# Altium project PFC-01v4.03.PrjPCB
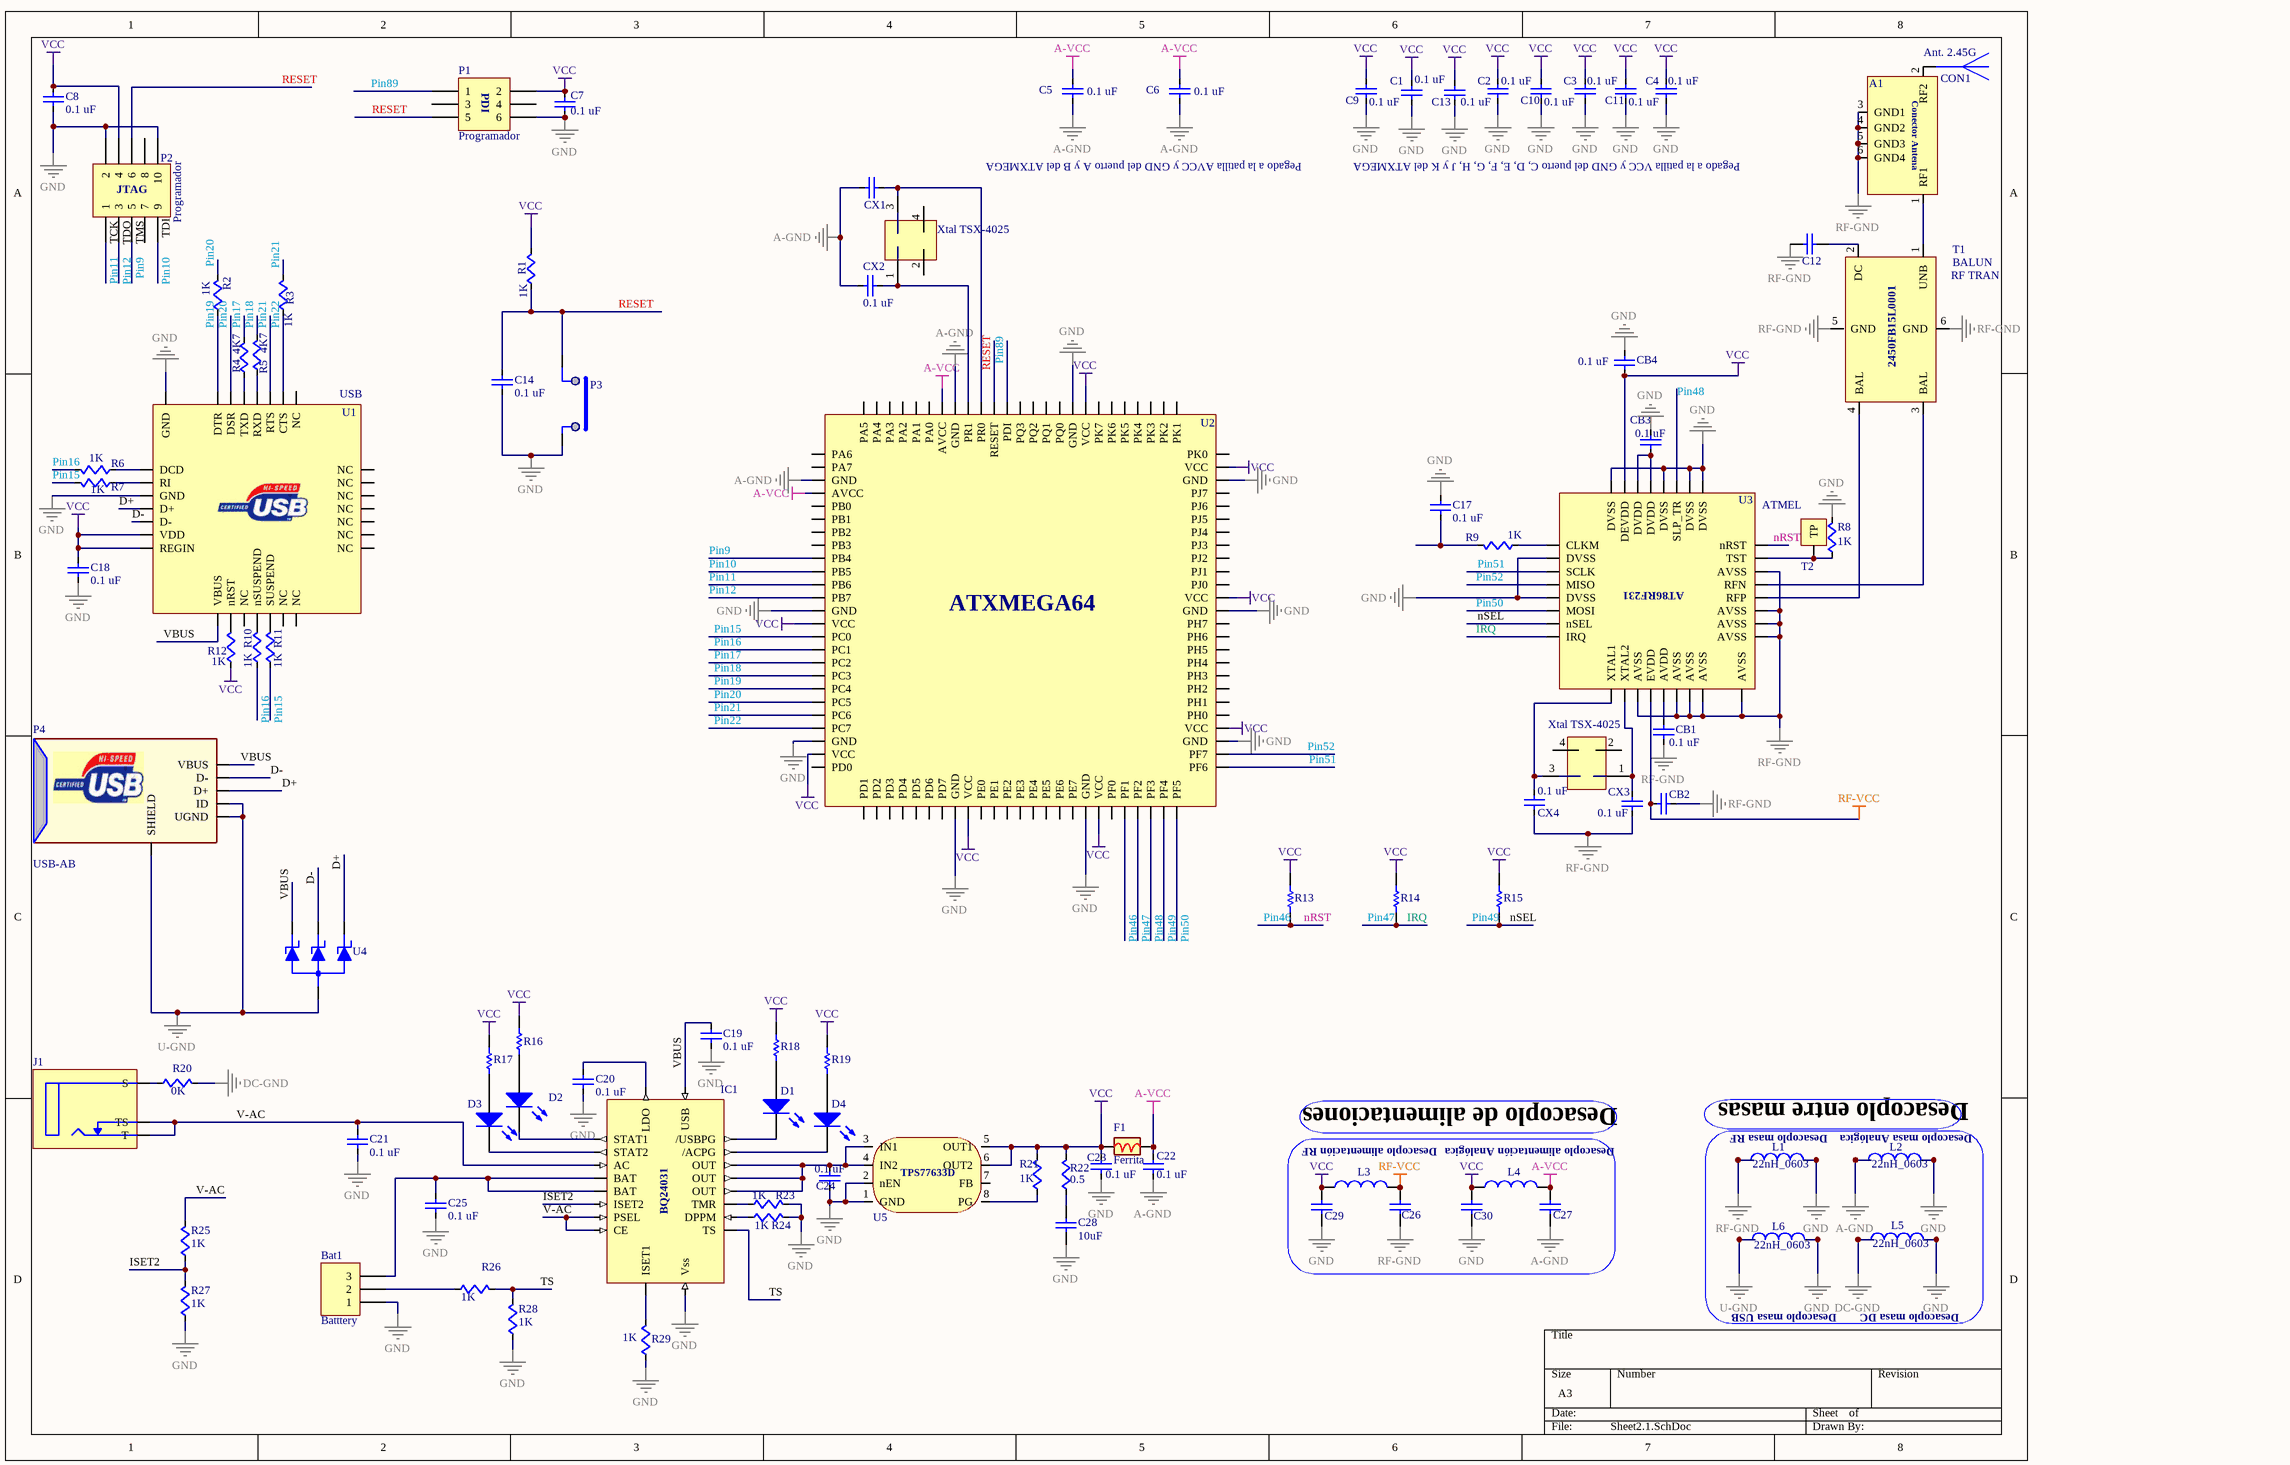
[diagram p0: Sheet2.1.SchDoc]
1 sheet, 94 parts. Net scope: global (net labels, ports and power ports of the same name join across sheets).
Board file: PFCv04.03.PcbDoc

## Sheet Sheet2.1.SchDoc
size A3; PageSetup: Record=PageOptions|CenterHorizontal=True|CenterVertical=True|PrintScale=0.73|XCorrection=1.00|YCorrection=1.00|PrintKind=1|BorderSize=5000000|LeftOffset=0|BottomOffset=0|Orientation=2|PaperLength=1000|PaperWidth=1000|Scale=100|PaperSource=15|PrintQuality=600|MediaType=1|DitherType=10|PaperKind=A4|PrintScaleMode=1

### Parts
A1  Ant. 2.45G  [ANTENNA CHIP]
Bat1  Batttery  [HDR1X3]
C1  Valor: 0.1 uF  [0402]  (hidden comment: C)
C2  Valor: 0.1 uF  [0402]  (hidden comment: C)
C3  Valor: 0.1 uF  [0402]  (hidden comment: C)
C4  Valor: 0.1 uF  [0402]  (hidden comment: C)
C5  Valor: 0.1 uF  [0402]  (hidden comment: C)
C6  Valor: 0.1 uF  [0402]  (hidden comment: C)
C7  Valor: 0.1 uF  [0402]  (hidden comment: C)
C8  Valor: 0.1 uF  [0402]  (hidden comment: C)
C9  Valor: 0.1 uF  [0402]  (hidden comment: C)
C10  Valor: 0.1 uF  [0402]  (hidden comment: C)
C11  Valor: 0.1 uF  [0402]  (hidden comment: C)
C12  22pF_0402  [0402]  (value not drawn)
C13  Valor: 0.1 uF  [0402]  (hidden comment: C)
C14  Valor: 0.1 uF  [0402]  (hidden comment: C)
C17  Valor: 0.1 uF  [0402]  (hidden comment: C)
C18  Valor: 0.1 uF  [0402]  (hidden comment: C)
C19  Valor: 0.1 uF  [0402]  (hidden comment: C)
C20  Valor: 0.1 uF  [0402]  (hidden comment: C)
C21  Valor: 0.1 uF  [0402]  (hidden comment: C)
C22  Valor: 0.1 uF  [0402]  (hidden comment: C)
C23  Valor: 0.1 uF  [0402]  (hidden comment: C)
C24  Valor: 0.1 uF  [0402]  (hidden comment: C)
C25  Valor: 0.1 uF  [0402]  (hidden comment: C)
C26  100nF_0805  [0805]  (value not drawn)
C27  100nF_0805  [0805]  (value not drawn)
C28  10uF  [0805]
C29  100nF_0805  [0805]  (value not drawn)
C30  100nF_0805  [0805]  (value not drawn)
CB1  Valor: 0.1 uF  [0402]  (hidden comment: C)
CB2  Valor: 0.1 uF  [0402]  (hidden comment: C)
CB3  Valor: 0.1 uF  [0402]  (hidden comment: C)
CB4  Valor: 0.1 uF  [0402]  (hidden comment: C)
CON1  Conector Antena  [MM8430-2600_Coaxial Connectors]  (value not drawn)
CX1  C  [0402]  (value not drawn)
CX2  Valor: 0.1 uF  [0402]  (hidden comment: C)
CX3  Valor: 0.1 uF  [0402]  (hidden comment: C)
CX4  C  [0402]  (value not drawn)
D1  Diodo Led  [Diode Led]  (value not drawn)
D2  Diodo Led  [Diode Led]  (value not drawn)
D3  Diodo Led  [Diode Led]  (value not drawn)
D4  Diodo Led  [Diode Led]  (value not drawn)
F1  Ferrita  [0603]
IC1  BQ24031  [BQ24031]  (value not drawn)
J1  CAMSHOT  [MJ-2509N]  (value not drawn)
L1  22nH_0603  [0603]
L2  22nH_0603  [0603]
L3  22nH_0603  [0603]  (value not drawn)
L4  22nH_0603  [0603]  (value not drawn)
L5  22nH_0603  [0603]
L6  22nH_0603  [0603]
P1  Programador  [HDR2X3]
P2  Programador  [HDR2X5]
P3  Pulsador  [PUSH-BUTTON-W]  (value not drawn)
P4  USB-AB  [USB-MINI-AB-SMT]
R1  value 1K  [0603]  (hidden comment: R 0402)
R2  value 1K  [0603]  (hidden comment: R 0402)
R3  value 1K  [0603]  (hidden comment: R 0402)
R4  value 4K7  [0603]  (hidden comment: R 0402)
R5  value 4K7  [0603]  (hidden comment: R 0402)
R6  value 1K  [0603]  (hidden comment: R 0402)
R7  value 1K  [0603]  (hidden comment: R 0402)
R8  value 1K  [0603]  (hidden comment: R 0402)
R9  value 1K  [0603]  (hidden comment: R 0402)
R10  value 1K  [0603]  (hidden comment: R 0402)
R11  value 1K  [0603]  (hidden comment: R 0402)
R12  value 1K  [0603]  (hidden comment: R 0402)
R13  16.9kohm-0805  [0805]  (value not drawn)
R14  16.9kohm-0805  [0805]  (value not drawn)
R15  16.9kohm-0805  [0805]  (value not drawn)
R16  16.9kohm-0805  [0805]  (value not drawn)
R17  16.9kohm-0805  [0805]  (value not drawn)
R18  16.9kohm-0805  [0805]  (value not drawn)
R19  16.9kohm-0805  [0805]  (value not drawn)
R20  value 0K  [0603]  (hidden comment: R 0402)
R21  value 1K  [0603]  (hidden comment: R 0402)
R22  value 0.5  [0603]  (hidden comment: R 0402)
R23  value 1K  [0603]  (hidden comment: R 0402)
R24  value 1K  [0603]  (hidden comment: R 0402)
R25  value 1K  [0603]  (hidden comment: R 0402)
R26  value 1K  [0603]  (hidden comment: R 0402)
R27  value 1K  [0603]  (hidden comment: R 0402)
R28  value 1K  [0603]  (hidden comment: R 0402)
R29  value 1K  [0603]  (hidden comment: R 0402)
T1  BALUN  [BALUN]
T2  TESTPOINT  [TESTPOINT]  (value not drawn)
U1  USB  [QFN28_5X5]
U2  XMEGA  [Quad100]  (value not drawn)
U3  RF TRAN  Fabricante: ATMEL  [QFN32_50]
U4  TVS  [SOT-143]  (value not drawn)
U5  TPS77633D  [TPS77633D]  (value not drawn)
Xtal1  Xtal TSX-4025  [TSX-4025]
Xtal2  Xtal TSX-4025  [TSX-4025]

### Blocks framed on the sheet
Desacoplo alimentación RF: C26 C27 C29 C30 L3 L4

### Nets
A-GND: C5.2 C6.2 C22.2 C27.1 CX1.1 CX2.1 L2.1 U2.3(GND) U2.93(GND)
A-VCC: C5.1 C6.1 C22.1 C27.2 F1.2(Y) L4.2 U2.4(AVCC) U2.94(AVCC)
DC-GND: L5.1 R20.2
GND: Bat1.1 C1.2 C2.2 C3.2 C4.2 C7.2 C8.2 C9.2 C10.2 C11.2 C13.2 C14.2 C17.1 C18.2 C19.2 C20.2 C21.2 C23.2 C24.2 C25.2 C28.1 C29.1 C30.1 CB3.1 CB4.2 IC1.11(Vss) L1.2 L2.2 L5.2 L6.2 P1.6 P2.2 P2.10 P3.2 R8.2 R23.2 R24.2 R27.1 R28.1 R29.1 U1.0(GND) U1.3(GND) U2.13(GND) U2.23(GND) U2.33(GND) U2.43(GND) U2.53(GND) U2.63(GND) U2.73(GND) U2.84(GND) U3.9(DVSS) U3.10(DVSS) U3.12(DVSS) U3.16(DVSS) U3.18(DVSS) U3.21(DVSS) U5.1(GND) U5.2(nEN)
RF-GND: C12.1 C26.1 CB1.1 CB2.1 CON1.3(GND1) CON1.4(GND2) CON1.5(GND3) CON1.6(GND4) CX3.1 CX4.1 L1.1 T1.5(GND) T1.6(GND) U3.1(AVSS) U3.2(AVSS) U3.3(AVSS) U3.6(AVSS) U3.27(AVSS) U3.30(AVSS) U3.31(AVSS) U3.32(AVSS) U3.33(AVSS)
RF-VCC: C26.2 CB2.2 L3.2 U3.28(EVDD)
U-GND: L6.1 P4.ID P4.SHIELD P4.UGND U4.1(GND)
VCC: C1.1 C2.1 C3.1 C4.1 C7.1 C8.1 C9.1 C10.1 C11.1 C13.1 C18.1 C23.1 C29.2 C30.2 CB4.1 F1.1(X) L3.1 L4.1 P1.2 P2.4 R1.2 R12.1 R13.2 R14.2 R15.2 R16.2 R17.2 R18.2 R19.2 R21.2 R22.2 U1.6(VDD) U1.7(REGIN) U2.14(VCC) U2.24(VCC) U2.34(VCC) U2.44(VCC) U2.54(VCC) U2.64(VCC) U2.74(VCC) U2.83(VCC) U3.15(DEVDD) U5.5(OUT1) U5.6(OUT2)
D+: P4.D+ U1.4(D+) U4.2(C)
D-: P4.D- U1.5(D-) U4.3(C)
IRQ: R14.1 U2.47(PF2) U3.24(IRQ)  [also labelled Pin47]
ISET2: IC1.7(ISET2) R25.1 R27.2
nRST: R13.1 U2.46(PF1) U3.8(nRST)  [also labelled Pin46]
nSEL: R15.1 U2.49(PF4) U3.23(nSEL)  [also labelled Pin49]
Pin9: P2.5 U2.9(PB4)
Pin10: P2.9 U2.10(PB5)
Pin11: P2.1 U2.11(PB6)
Pin12: P2.3 U2.12(PB7)
Pin15: R7.2 R11.1 U2.15(PC0)
Pin16: R6.2 R10.1 U2.16(PC1)
Pin17: R4.2 U2.17(PC2)
Pin18: R5.2 U2.18(PC3)
Pin19: R2.1 U1.28(DTR) U2.19(PC4)
Pin20: R2.2 U1.27(DSR) U2.20(PC5)
Pin21: R3.2 U1.24(RTS) U2.21(PC6)
Pin22: R3.1 U1.23(CTS) U2.22(PC7)
Pin48: U2.48(PF3) U3.11(SLP_TR)
Pin50: U2.50(PF5) U3.22(MOSI)
Pin51: U2.51(PF6) U3.19(SCLK)
Pin52: U2.52(PF7) U3.20(MISO)
Pin89: P1.1 U2.89(PDI)
RESET: C14.1 P1.5 P2.6 P3.1 R1.1 U2.90(RESET)
TS: IC1.12(TS) R26.2 R28.2
V-AC: C21.1 IC1.4(AC) IC1.8(PSEL) IC1.9(CE) J1.2(T) J1.3(TS) R25.2
VBUS: C19.1 IC1.20(USB) P4.VBUS U1.8(VBUS) U4.4(C)
NetA1_1: A1.1(OUT) CON1.2(RF2)
NetBat1_2: Bat1.2 R26.1
NetBat1_3: Bat1.3 C25.1 IC1.5(BAT) IC1.6(BAT)
NetC12_2: C12.2 T1.2(DC)
NetC17_2: C17.2 R9.2
NetC20_1: C20.1 IC1.1(LDO)
NetC24_1: C24.1 IC1.15(OUT) IC1.16(OUT) IC1.17(OUT) U5.3(IN1) U5.4(IN2)
NetC28_2: C28.2 R22.1
NetCB1_2: CB1.2 U3.29(AVDD)
NetCB3_2: CB3.2 U3.13(DVDD) U3.14(DVDD)
NetCON1_1: CON1.1(RF1) T1.1(UNB)
NetCX1_2: CX1.2 U2.91(PR0) Xtal1.3(OSC2)
NetCX2_2: CX2.2 U2.92(PR1) Xtal1.1(OSC1)
NetCX3_2: CX3.2 U3.26(XTAL2) Xtal2.1(OSC1)
NetCX4_2: CX4.2 U3.25(XTAL1) Xtal2.3(OSC2)
NetD1_1: D1.1(A) R18.1
NetD1_2: D1.2(K) IC1.19(/USBPG)
NetD2_1: D2.1(A) R16.1
NetD2_2: D2.2(K) IC1.2(STAT1)
NetD3_1: D3.1(A) R17.1
NetD3_2: D3.2(K) IC1.3(STAT2)
NetD4_1: D4.1(A) R19.1
NetD4_2: D4.2(K) IC1.18(/ACPG)
NetIC1_10: IC1.10(ISET1) R29.2
NetIC1_13: IC1.13(DPPM) R23.1
NetIC1_14: IC1.14(TMR) R24.1
NetJ1_1: J1.1(S) R20.1
NetR4_1: R4.1 U1.26(TXD)
NetR5_1: R5.1 U1.25(RXD)
NetR6_1: R6.1 U1.1(DCD)
NetR7_1: R7.1 U1.2(RI)
NetR8_1: R8.1 T2.1(TP) U3.7(TST)
NetR9_1: R9.1 U3.17(CLKM)
NetR10_2: R10.2 U1.11(nSUSPEND)
NetR11_2: R11.2 U1.12(SUSPEND)
NetR12_2: R12.2 U1.9(nRST)
NetR21_1: R21.1 U5.8(PG)
NetT1_3: T1.3(BAL) U3.5(RFN)
NetT1_4: T1.4(BAL) U3.4(RFP)

Not connected (* = marked no-connect by the designer): P1 3 4; P2 7 8; U1 10(NC) 13(NC) 14(NC) 15(NC) 16(NC) 17(NC) 18(NC) 19(NC) 20(NC) 21(NC) 22(NC); U2 1(PA6) 2(PA7) 5(PB0) 6(PB1) 7(PB2) 8(PB3) 25(PD0) 26(PD1) 27(PD2) 28(PD3) 29(PD4) 30(PD5) 31(PD6) 32(PD7) 35(PE0) 36(PE1) 37(PE2) 38(PE3) 39(PE4) 40(PE5) 41(PE6) 42(PE7) 45(PF0) 55(PH0) 56(PH1) 57(PH2) 58(PH3) 59(PH4) 60(PH5) 61(PH6) 62(PH7) 65(PJ0) 66(PJ1) 67(PJ2) 68(PJ3) 69(PJ4) 70(PJ5) 71(PJ6) 72(PJ7) 75(PK0) 76(PK1) 77(PK2) 78(PK3) 79(PK4) 80(PK5) 81(PK6) 82(PK7) 85(PQ0) 86(PQ1) 87(PQ2) 88(PQ3) 95(PA0) 96(PA1) 97(PA2) 98(PA3) 99(PA4) 100(PA5); U5 7(FB); Xtal1 2(OSC2) 4(OSC2); Xtal2 2(OSC2) 4(OSC2)

### Notes on the sheet
- Pegado a la patilla AVCC y GND del puerto A y B del ATXMEGA
- Pegado a la patilla VCC y GND del puerto C, D, E, F, G, H, J y K del ATXMEGA
- Desacoplo de alimentaciones
- Desacoplo entre masas
- Desacoplo alimentación Analógica
- (near L1) Desacoplo masa RF
- (near L2) Desacoplo masa Analógica
- Desacoplo masa USB
- Desacoplo masa DC
- Labels drawn without touching a wire or pin: TCK, TDI, TDO, TMS
- (in symbol 2450FB39B100E) 2450FB15L0001
- (in symbol ATXMEGA64A1) ATXMEGA64
- (in symbol Header 3X2) PDI
- (in symbol Header 5X2) JTAG

### Library data of the parts
A1 = 2450AT18A100: ANTENNA CHIP 2.4GHZ; Proveedor: DIGIKEY; Fabricante: Johanson Technology; Modelo: 2450AT18A100E; DIGIKEY: 712-1005-1-ND
Bat1 = Header 3: Header, 3-Pin; Publisher: Altium Limited; LatestRevisionDate: 17-Jul-2002; LatestRevisionNote: Re-released for DXP Platform.
C1-C11 C13 C14 C17-C25 CB1-CB4 CX2 CX3 = C: CONDENSADOR
C12 = 56pF_0402: CAP CER 56PF 50V 5% C0G 0402; Proveedor: Digikey; Modelo: GRM1555C1H560JD01D; Fabricante: Murata Electronics North America; Digikey: 490-1288-1-ND
C26 C27 C29 C30 = 100nF_0805: CAP CER 100PF 630V X7R 0805; Proveedor: Digikey; Fabricante: AVX Corporation; Modelo: 08055C104JAT2A; Digikey: 478-3352-1-ND
C28 = 10uF_0805: CAP CER 10UF 10V Y5V 0805; Proveedor: Digikey; Modelo: C2012Y5V1A106Z; Fabricante: TDK CORPORATION; Digikey: 445-1371-1-ND
CON1 = CON ANT-MM8430-2600RA1: CONN MW COAXIAL WITH SWITCH; Proveedor: DIGIKEY
CX1 CX4 = C: CONDENSADOR; Valor: 0.1 uF
D1-D4 = LTST-C230CKT: Typical INFRARED GaAs LED; Fabricante: Lite-On Inc; Proveedor: Digikey; Digikey: 160-1186-1-ND; Modelo: LTST-C230CKT
F1 = BLM21AH102SN1: Chip Ferrite Beads
IC1 = BQ24031: IC PWR MANAGEMENT SYSTEM 20-QFN; Fabricante: Texas Instruments; Modelo: BQ24031RHLR; Proveedor: DIGIKEY; DIGIKEY: 296-21372-1-ND
J1 = MJ-2509N_1: CONN MONO JACK 2.5MM PCB MNT; Fabricante: CUI Inc; Proveedor: DIGIKEY; Modelo: MJ-2509N; DIGIKEY: CP-M2509N-ND
L1-L6 = 22nH_0603: CER INDUCTOR 22NH 0603; Proveedor: Digikey; Modelo: L-14C22NJV4T; Fabricante: Johanson Technology Inc; Digikey: 712-1438-1-ND
P1 = Header 3X2: Header, 3-Pin, Dual row; LatestRevisionDate: 17-Jul-2002; LatestRevisionNote: Re-released for DXP Platform.; Publisher: Altium Limited
P2 = Header 5X2: Header, 5-Pin, Dual row; LatestRevisionDate: 17-Jul-2002; LatestRevisionNote: Re-released for DXP Platform.; Publisher: Altium Limited
P3 = PUSHBUTTON: SWITCH TACT 6X3.5MM H=4.3MM 180G; Proveedor: DIGIKEY; Modelo: TL1107AF180WQ; Fabricante: E-Switch; DIGIKEY: EG2511-ND
P4 = WM1722: CONN RECEPT USB 5POS RT ANG SMD; Proveedor: DIGIKEY; Fabricante: Molex; Modelo: 56579-0576; DIGIKEY: WM17122CT-ND
R1-R12 R20-R29 = R 0402: RESISTENCIA 0402 SMD; Proveedor: DIGIKEY
R13-R19 = 16.9kohm-0805: RES 16.9K OHM 1/8W 1% 0805 SMD; Modelo: MCR10EZPF1692; Fabricante: Rohm Semiconductor; Proveedor: Digikey; Digikey: RHM16.9KCRCT-ND
T1 = 2450FB39B100E: FILTER BALUN CER CHIP 2.4GHZ; Proveedor: DIGIKEY; Fabricante: Johanson Technology; DIGIKEY: 712-1068-1-ND; Modelo: 2450FB39B100E
T2 = TESTPOINT: Punto de Test; Fabricante: N/A; Modelo: N/A; Proveedor: N/A
U1 = CP2102: IC USB-TO-UART BRIDGE 28MLP; Fabricante: SiLabs; Modelo: CP2102-GM; Proveedor: DIGIKEY; DIGIKEY: 336-1160-ND; helpURL: ..\..\Datasheets\USB\cp2102\cp2102.pdf
U2 = ATXMEGA64A1: MCU AVR 64K FLASH 1.6V 100-TQFP; Modelo: ATXMEGA64A1-AU; Proveedor: ESPER-CHAIN; Fabricante: Atmel; DIGIKEY: ATXMEGA64A1-AU-ND
U3 = AT86RF231: IC TXRX ZIGBEE/802.15.4 32QFN; Proveedor: DIGIKEY; Modelo: AT86RF230-ZU; DIGIKEY: AT86RF230-ZU-ND
U4 = SP0503BAHTG: TVS AVAL DIODE ARRAY 3 CH SOT143; Fabricante: Litttlefuse; Proveedor: DIGIKEY; Modelo: SP0503BAHTG; DIGIKEY: F2715CT-ND
U5 = TPS77633D: IC 3.3V 500MA LDO REG 8-SOIC; Proveedor: DIGIKEY; Fabricante: Texas Instruments; Modelo: TPS77633D; DIGIKEY: 296-2782-5-ND
Xtal1 Xtal2 = Xtal TSX-4025: Cristal 16Mhz; Fabricante: *; Modelo: *; Proveedor: *; DIGIKEY: *